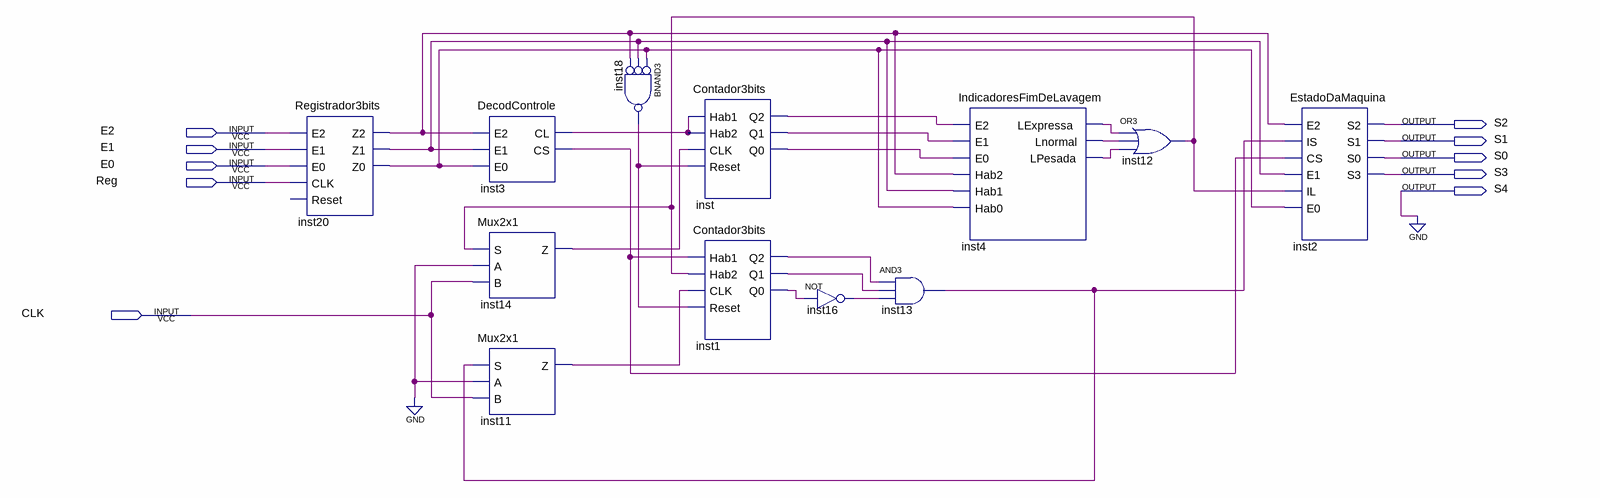
[diagram p0: schematic sheet]
// Quartus schematic Maquina.bdf as structural Verilog: 12 symbols, 10 pins
module Maquina (
  input  E2,
  input  E1,
  input  E0,
  input  Reg,
  input  CLK,
  output S2,
  output S1,
  output S0,
  output S3,
  output S4
);

  wire inst1_q0, inst1_q1, inst1_q2, inst3_cl, inst3_cs, inst4_lexpressa, inst4_lnormal, inst4_lpesada,
       inst11_z, inst12_out, inst13_out, inst14_z, inst16_out, inst18_out, inst20_z0, inst20_z1, inst20_z2,
       inst_q0, inst_q1, inst_q2;

  Registrador3bits inst20 (
    .E2(E2), .E1(E1), .E0(E0), .CLK(Reg), .Z2(inst20_z2), .Z1(inst20_z1), .Z0(inst20_z0));  // open: Reset
  DecodControle inst3 (.E2(inst20_z2), .E1(inst20_z1), .E0(inst20_z0), .CL(inst3_cl), .CS(inst3_cs));
  Mux2x1 inst14 (.S(inst12_out), .A(1'b0), .B(CLK), .Z(inst14_z));
  Mux2x1 inst11 (.S(inst13_out), .A(1'b0), .B(CLK), .Z(inst11_z));
  nand inst18 (inst18_out, ~inst20_z0, ~inst20_z1, ~inst20_z2);  // BNAND3
  Contador3bits inst (
    .Hab1(inst3_cl), .Hab2(inst3_cl), .CLK(inst14_z), .Reset(inst18_out), .Q2(inst_q2), .Q1(inst_q1),
    .Q0(inst_q0));
  Contador3bits inst1 (
    .Hab1(inst3_cs), .Hab2(inst12_out), .CLK(inst11_z), .Reset(inst18_out), .Q2(inst1_q2), .Q1(inst1_q1),
    .Q0(inst1_q0));
  not inst16 (inst16_out, inst1_q0);
  and inst13 (inst13_out, inst1_q2, inst1_q1, inst16_out);
  IndicadoresFimDeLavagem inst4 (
    .E2(inst_q2), .E1(inst_q1), .E0(inst_q0), .Hab2(inst20_z2), .Hab1(inst20_z1), .Hab0(inst20_z0),
    .LExpressa(inst4_lexpressa), .Lnormal(inst4_lnormal), .LPesada(inst4_lpesada));
  or inst12 (inst12_out, inst4_lexpressa, inst4_lnormal, inst4_lpesada);
  EstadoDaMaquina inst2 (
    .E2(inst20_z2), .IS(inst13_out), .CS(inst3_cs), .E1(inst20_z1), .IL(inst12_out), .E0(inst20_z0), .S2(S2),
    .S1(S1), .S0(S0), .S3(S3));

  assign S4 = 1'b0;
endmodule
